# Altium project ATH-SR5-Balance-PCB.PrjPcb
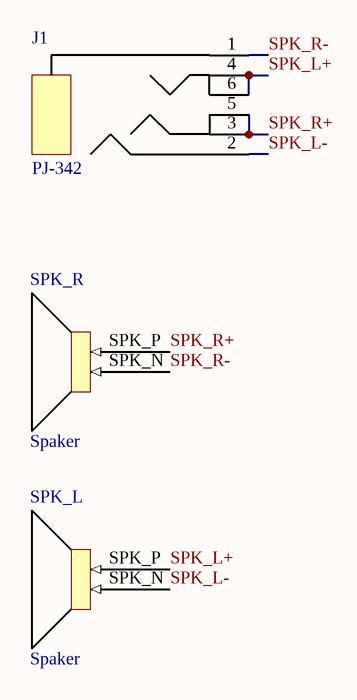
[diagram p0: Sheet.SchDoc]
1 sheet, 3 parts. Net scope: global (net labels, ports and power ports of the same name join across sheets).
Board file: Pcb.PcbDoc

## Sheet Sheet.SchDoc
size A4

### Parts
J1  PJ-342  [PJ-342]
SPK_L  Spaker  [SPAKER]
SPK_R  Spaker  [SPAKER]

### Nets
SPK_L+: J1.4 J1.6 SPK_L.SPK_P
SPK_L-: J1.2 SPK_L.SPK_N
SPK_R+: J1.3 J1.5 SPK_R.SPK_P
SPK_R-: J1.1 SPK_R.SPK_N